# EAGLE design Blo_Pen (EAGLE 9.6.2)
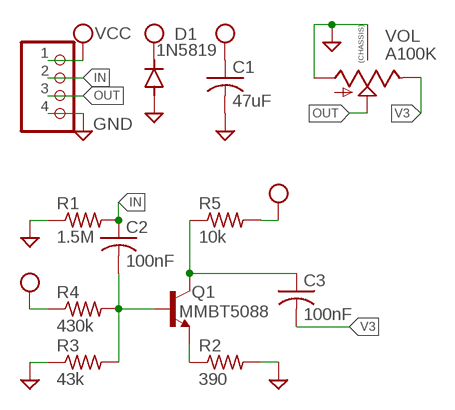
[diagram p0: schematic, sheet 1]

## Parts
C1  47uF  C-USC1210  [C1210]
C2  100nF  C-USC0603  [C0603]
C3  100nF  C-USC0603  [C0603]
D1  1N5819  DIODE-SOD123  [SOD123]
JP1  PINHD-1X4  [1X04]
Q1  MMBT5088  [SOT23-BEC]
R1  1.5M  R-US_R0603  [R0603]
R2  390  R-US_R0603  [R0603]
R3  43k  R-US_R0603  [R0603]
R4  430k  R-US_R0603  [R0603]
R5  10k  R-US_R0603  [R0603]
VOL  A100K  9MM_SNAP-IN_POT_CHASSIS  [9MM_SNAP-IN_POT]

## Nets
GND: C1.2 D1.A JP1.4 R1.1 R2.2 R3.1 VOL.1(A) VOL.CHASSIS1 VOL.CHASSIS2
IN: C2.1 JP1.2 R1.2
N$2: C2.2 Q1.B R3.2 R4.2
N$3: Q1.E R2.1
N$4: C3.1 Q1.C R5.1
OUT: JP1.3 VOL.2(S)
V3: C3.2 VOL.3(E)
VCC: C1.1 D1.C JP1.1 R4.1 R5.2

## Library data of the parts
C1 = rcl:C-US: CAPACITOR, American symbol; SPICEPREFIX: C
C2 C3 = adafruit:C-US: CAPACITOR, American symbol
D1 = diode:DIODE-: DIODE
JP1 = Connector:PINHD-1X4: PIN HEADER; CATEGORY: CONNECTOR; SUB-CATEGORY: PIN-HEADER
Q1 = MMBT5088_:MMBT5088*: NPN TRANSISTOR Check prices <https://pricing.snapeda.com/search/part/MMBT5088/?ref=eda>; AVAILABILITY: Good; DESCRIPTION: Bipolar (BJT) Transistor NPN 30V 100mA 50MHz 350mW Surface Mount SOT-23; MF: ON Semiconductor; MP: MMBT5088; PACKAGE: SOT-23-3 Fairchild Semiconductor; PRICE: None; PURCHASE-URL: https://pricing.snapeda.com/search/part/MMBT5088/?ref=eda
R1-R5 = adafruit:R-US_: RESISTOR, American symbol
VOL = MusicThingModular:9MM_SNAP-IN_POT_CHASSIS: 9mm vertical snap-in pot, Alpha / Panasonic style, with a connection to the metal chassis for grounding

## Board
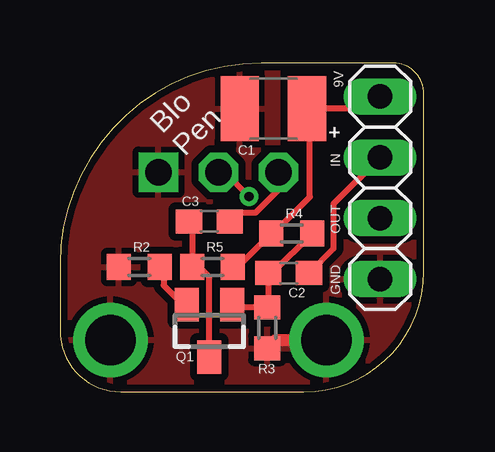
[diagram p1: board, top side]
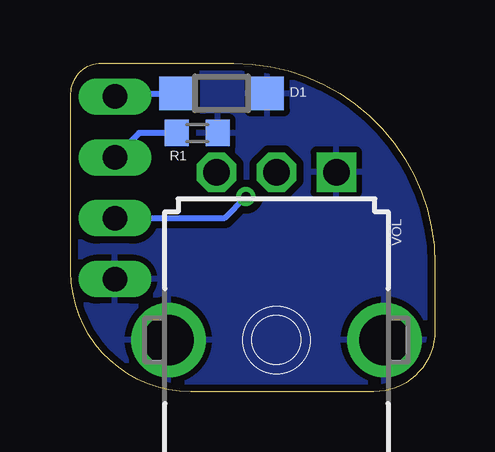
[diagram p2: board, bottom side, seen from below]

Size 15.16 x 13.71 mm. Coordinates in mm from the lower left corner, seen from the top.
Outline: 13.89,13.71 8.38,13.71 arc90 0,5.32 0,2.54 arc90 2.54,0 10.16,0 arc90 15.16,5 15.16,12.44 arc90 13.89,13.71
Copper layers (1*16): Top 0.035mm / dielectric 1.5mm / Bottom 0.035mm
Design rules "default *": minimum track width 6mil, minimum drill 0.35mm, track to track 6mil, track to pad 6mil, pad to pad 6mil, via to via 6mil, smd to smd 6mil, copper to edge 10mil, drill to drill 6mil, minimum pad ring 10mil, minimum via ring 8mil, stop-mask expansion 4mil, vias tented up to drill 0mil, thermal gap 10mil

### Footprints (pad centres in the part's own frame; a part is rotated, then mirrored left to right if it is on the bottom)
C1210 = smd 1.6 x 2.7: 1 -1.4,0; 2 1.4,0
C0603 = smd 1.1 x 1: 1 -0.85,0; 2 0.85,0
SOD123 = smd 1.4 x 1.4: A 1.9,0; C -1.9,0
1X04 = drill 1.016 long: 1 -3.81,0; 2 -1.27,0; 3 1.27,0; 4 3.81,0
SOT23-BEC = smd 1 x 1.4: B -0.95,-1.1; C 0,1.1; E 0.95,-1.1
R0603 = smd 1 x 1.1: 1 -0.85,0; 2 0.85,0
9MM_SNAP-IN_POT = drill 1.1 square: 1 -2.5,-7 | drill 1.1 octagon: 2 0,-7; 3 2.5,-7 | drill 2.1 pad 2.794: CHASSIS1 -4.5,0; CHASSIS2 4.5,0

### Placement (x,y rotation side)
C1  8.89,11.81 180 top
C2  9.53,4.95 180 top
C3  6.22,7.11 0 top
D1  8.89,12.45 0 bottom
JP1  13.34,8.51 270 top
Q1  6.22,2.54 180 top
R1  9.91,10.79 180 bottom
R2  3.3,5.21 180 top
R3  8.64,2.67 90 top
R4  9.65,6.6 0 top
R5  6.35,5.21 0 top
VOL  6.6,2.16 180 bottom

### Tracks (layer width: path | path; a pad name or v marks a point on that pad's centre or on a via)
GND
  Top 0.508: R3.1 8.98,2.16 VOL.CHASSIS2
  pour Top (isolate 0.305): -1.27,13.97 -1.27,-1.27 16.51,-1.27 16.51,13.97
  pour Bottom (isolate 0.305): -1.27,13.97 -1.27,-1.27 16.51,-1.27 16.51,13.97
IN
  Top 0.254: C2.1 11.39,5.97 11.39,7.83 JP1.2
  Bottom 0.254: R1.2 12.32,10.79 JP1.2
N$2
  Top 0.254: Q1.B 7.3,3.52 8.51,3.52 | R3.2 8.51,3.52 | R4.2 8.85,4.95 C2.2 8.68,3.68 8.51,3.52
N$3
  Top 0.254: R2.1 4.32,5.04 4.32,4.45 5.12,3.64 Q1.E
N$4
  Top 0.254: Q1.C 6.22,4.79 5.81,5.21 R5.1 5.5,6.99 C3.1
OUT  (via drill 0.38)
  Top 0.254: v7.87,8.14 6.86,9.16 VOL.2
  Bottom 0.254: v7.87,8.14 8.76,7.25 13.32,7.25 JP1.3
V3
  Top 0.254: C3.2 7.43,7.47 8.15,7.47 9.1,8.42 VOL.3
VCC
  Top 0.254: JP1.1 12.83,11.81 C1.1 10.41,11.69 10.41,8.13 8.89,6.6 R4.1 7.41,5.21 R5.2
  Bottom 0.254: JP1.1 13.21,12.45 D1.C

### Text on the board
tPlace: 9V | + | Blo / Pen | IN | OUT | GND